# EasyEDA schematic Amplifier V0.json
TITLE: Amplifier; REV: V0; Date: 2023-05-30; Sheet: 1/1; Drawn By: maks.hergesic; Company: /
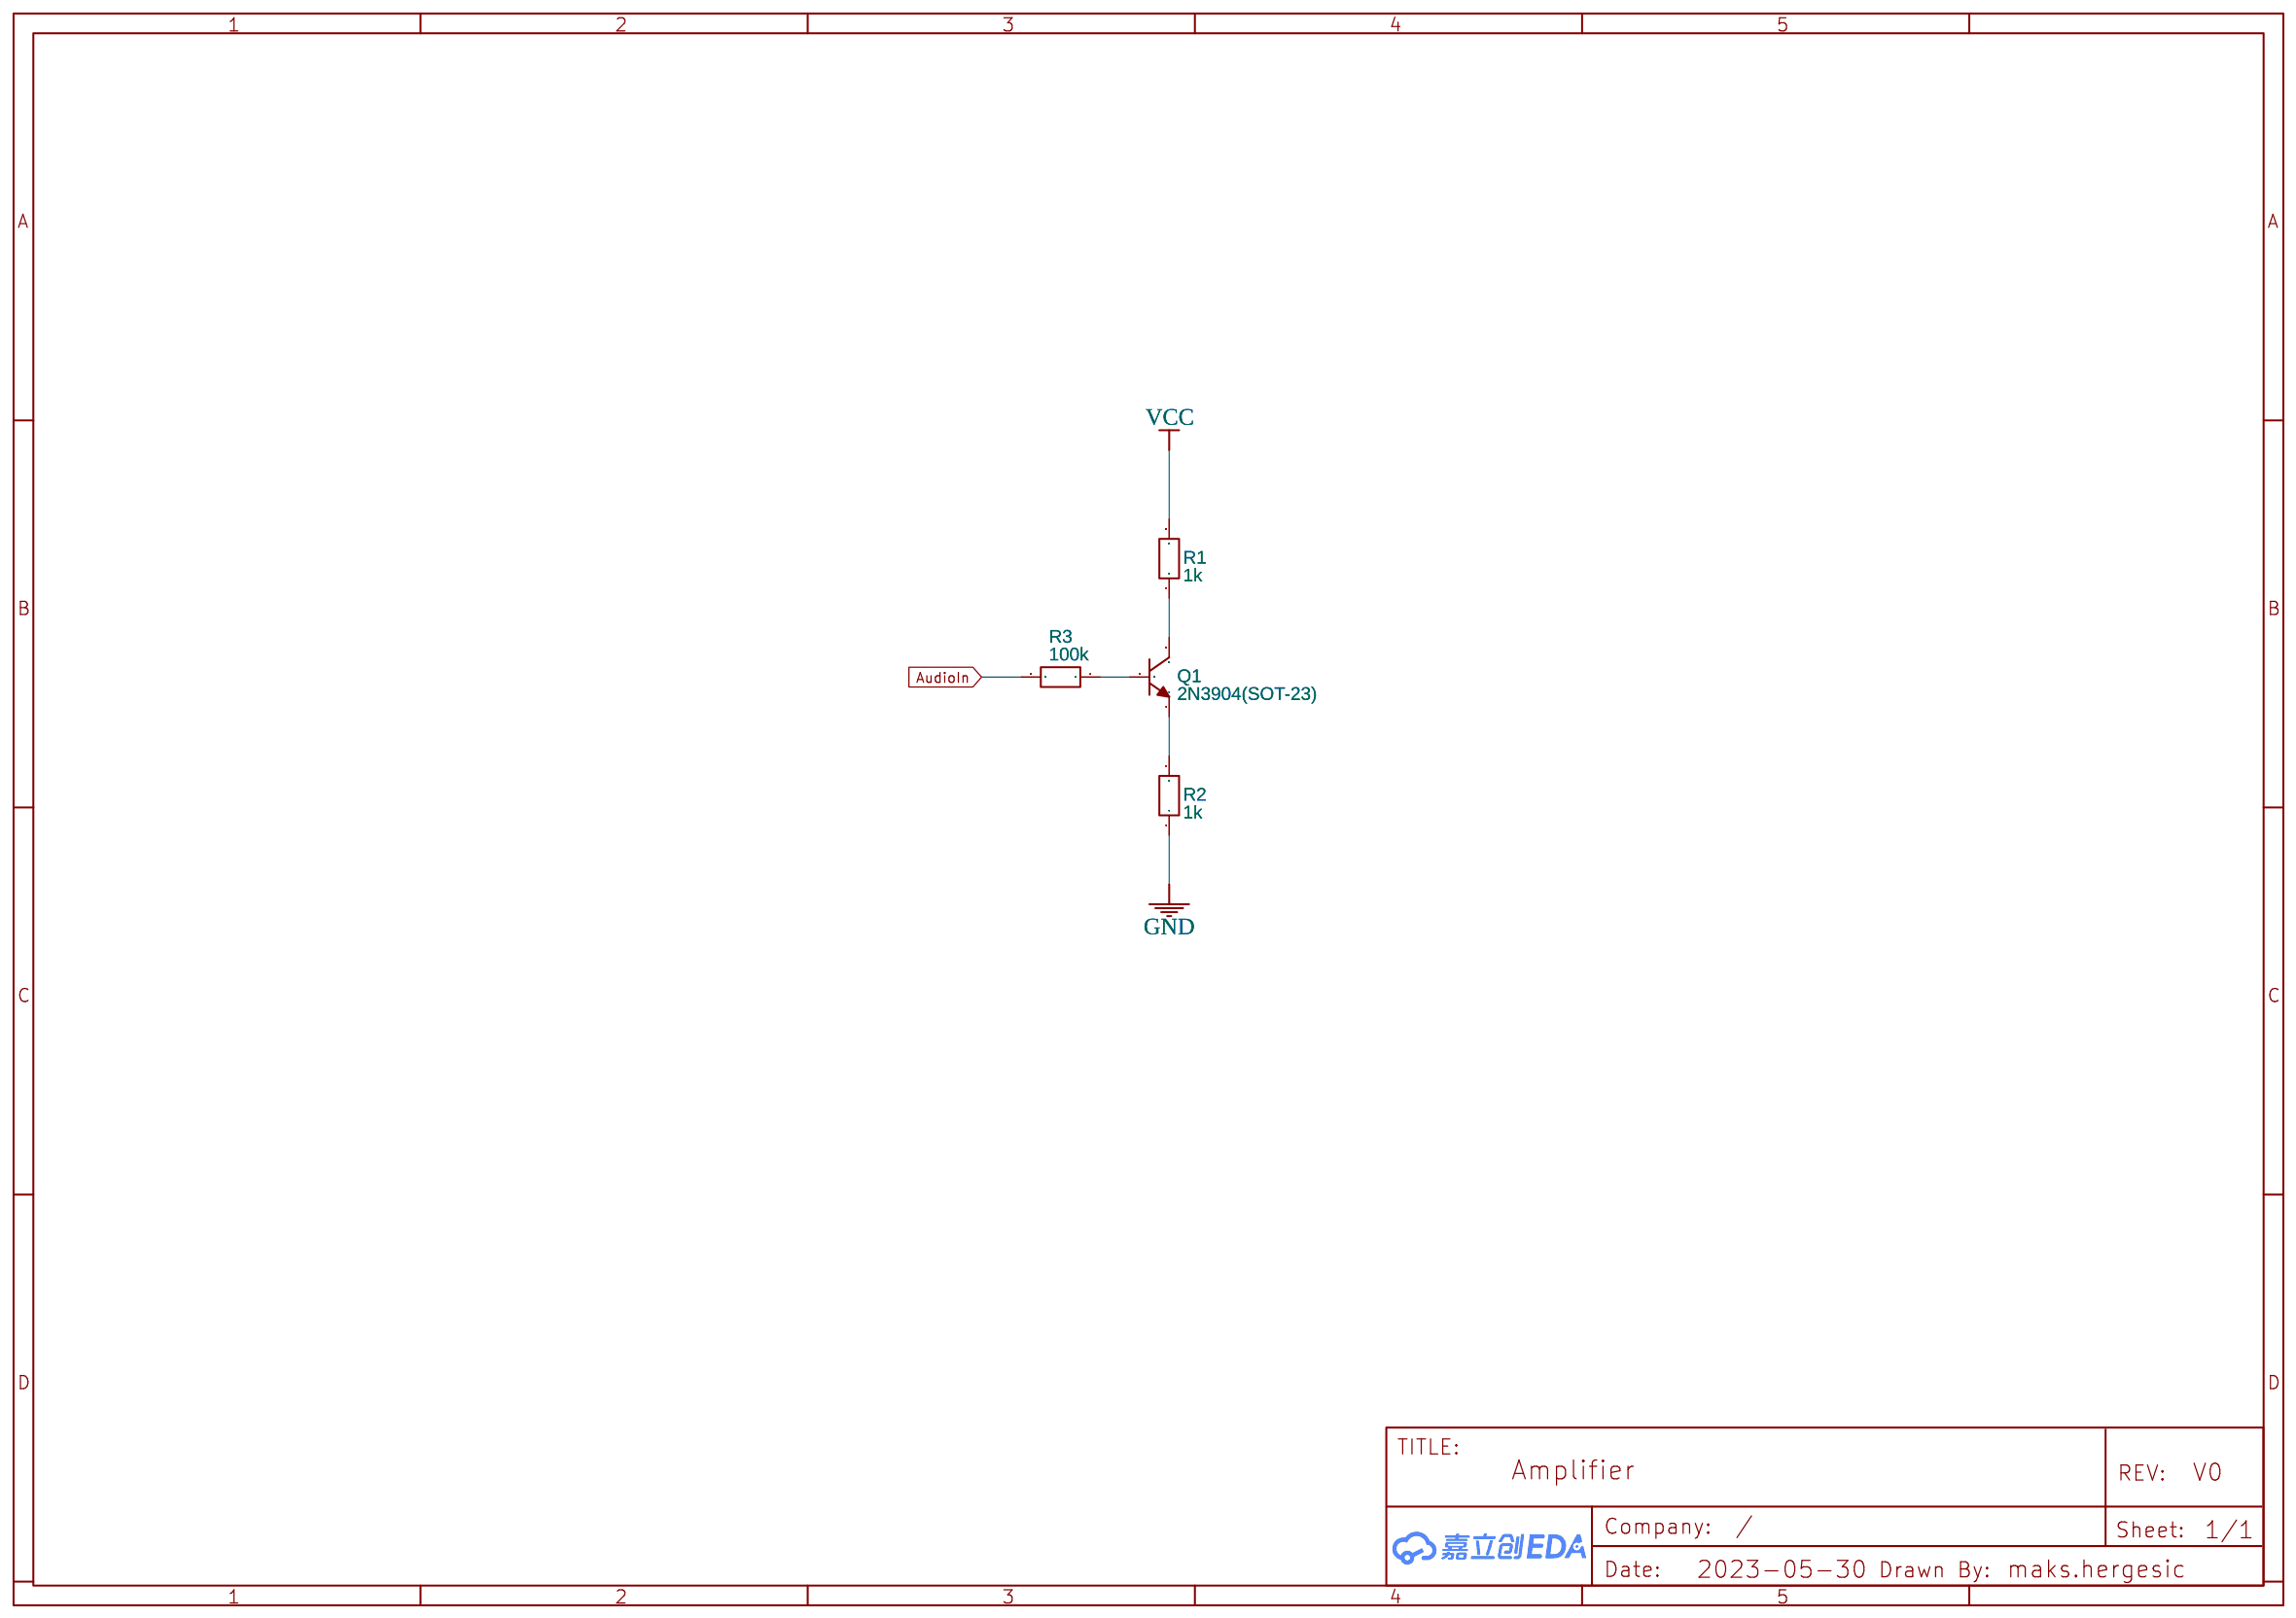
[diagram p0: schematic sheet]

## Parts
Q1  2N3904(SOT-23)  [SOT-23-3_L2.9-W1.3-P1.90-LS2.4-TR]
R1  1k  [R0603]
R2  1k  [R0603]
R3  100k  [R0603]

## Library data of the parts
Q1 = 2N3904(SOT-23): Supplier: LCSC; Manufacturer: KEC; Manufacturer Part: 2n3904S-RTK/PS; Supplier Part: C18536; Paste Type: SOT-23; Contributor: LCEDA_Lib
R1-R3 = R_0603_EU: Contributor: LCEDA_Lib

## Nets
GND: R2.1
VCC: R1.2
AudioIn: R3.2
Net-(Q1-1): Q1.1(E) R2.2
Net-(Q1-2): Q1.2(B) R3.1
Net-(Q1-3): Q1.3(C) R1.1
